# Altium schematic sheet Page B_SignalInput.SchDoc
size A1; SheetNumber: 0; SheetTotal: 0
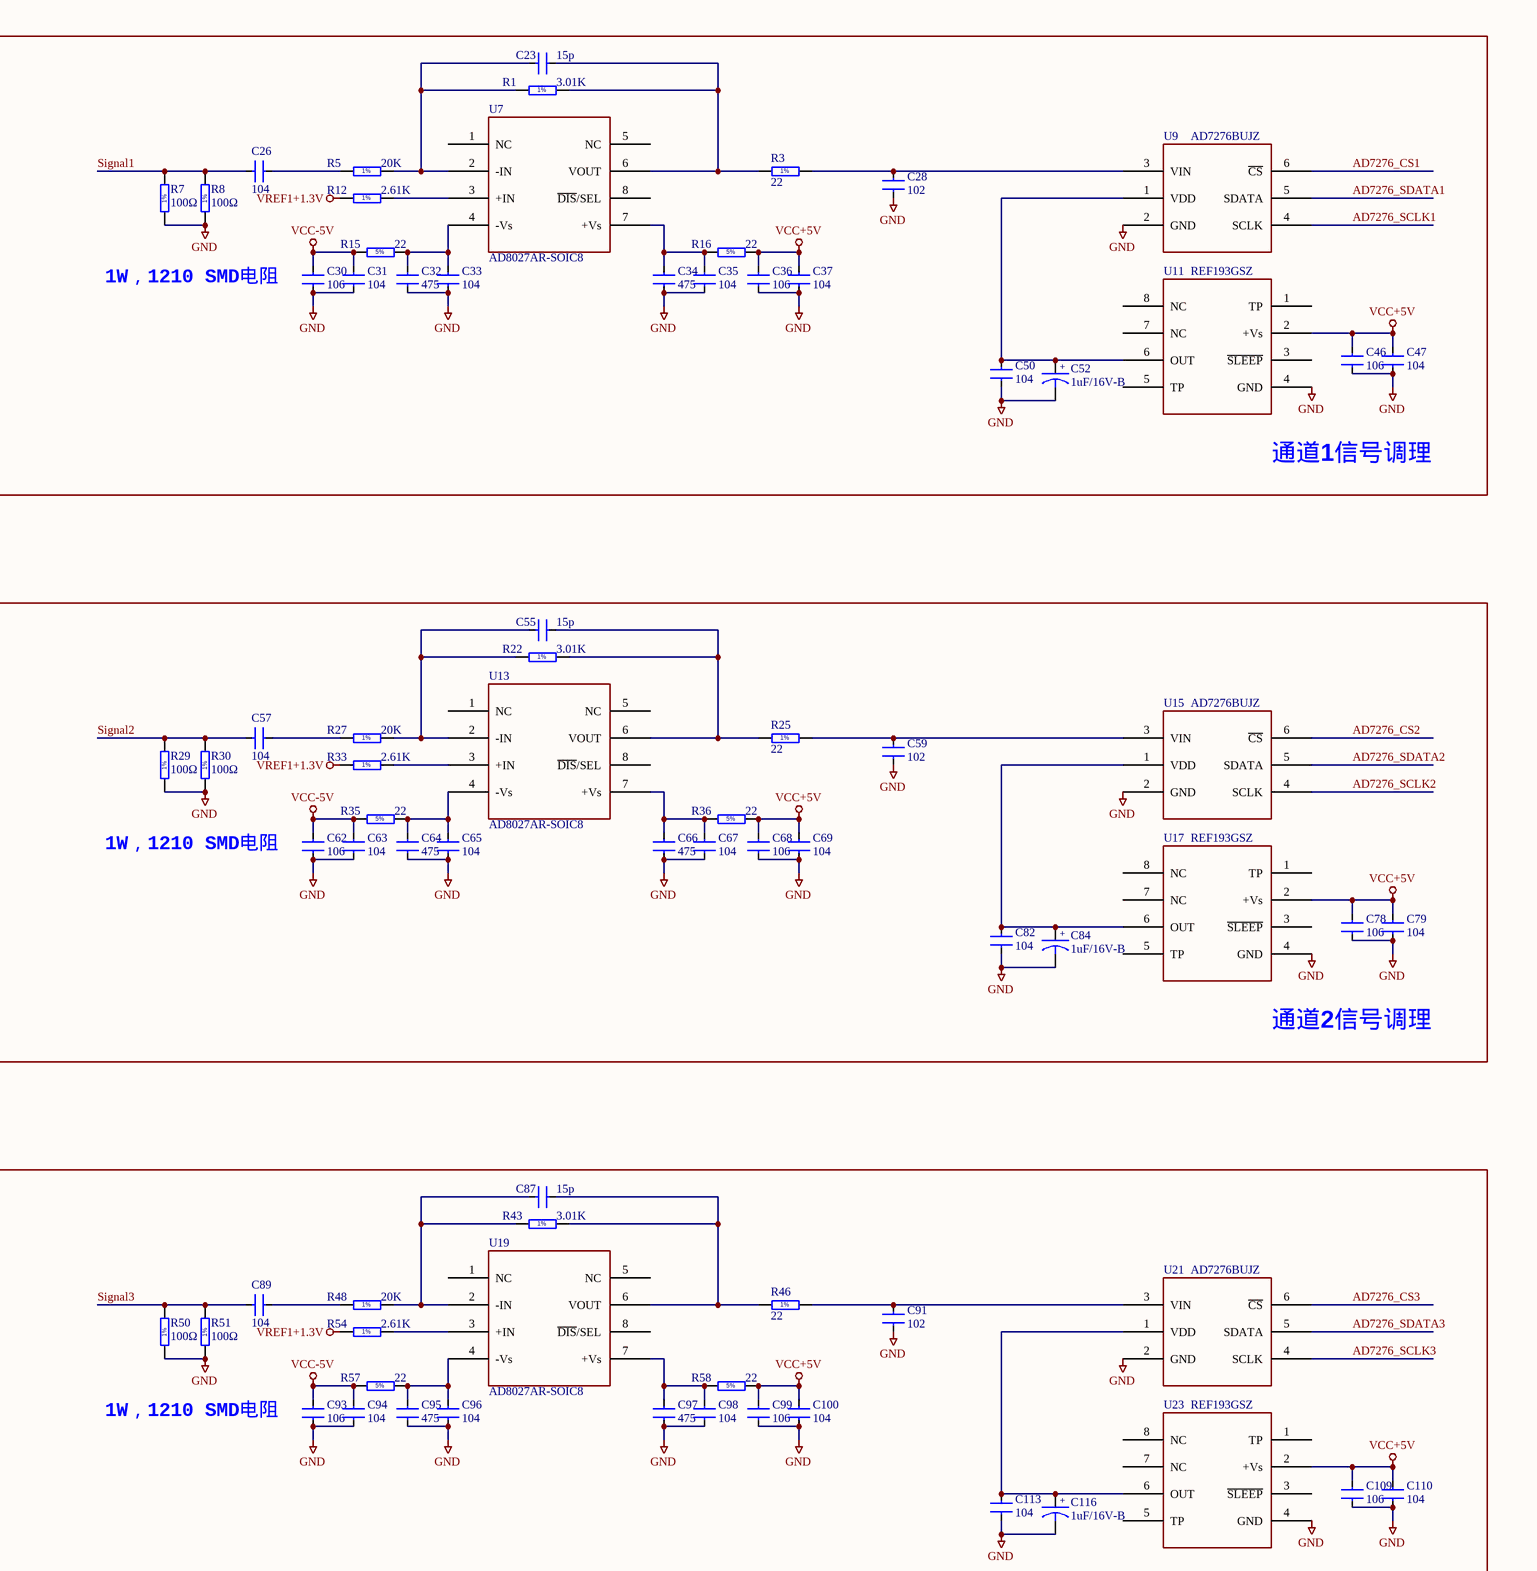
[diagram p0: Page B_SignalInput.SchDoc, top left]
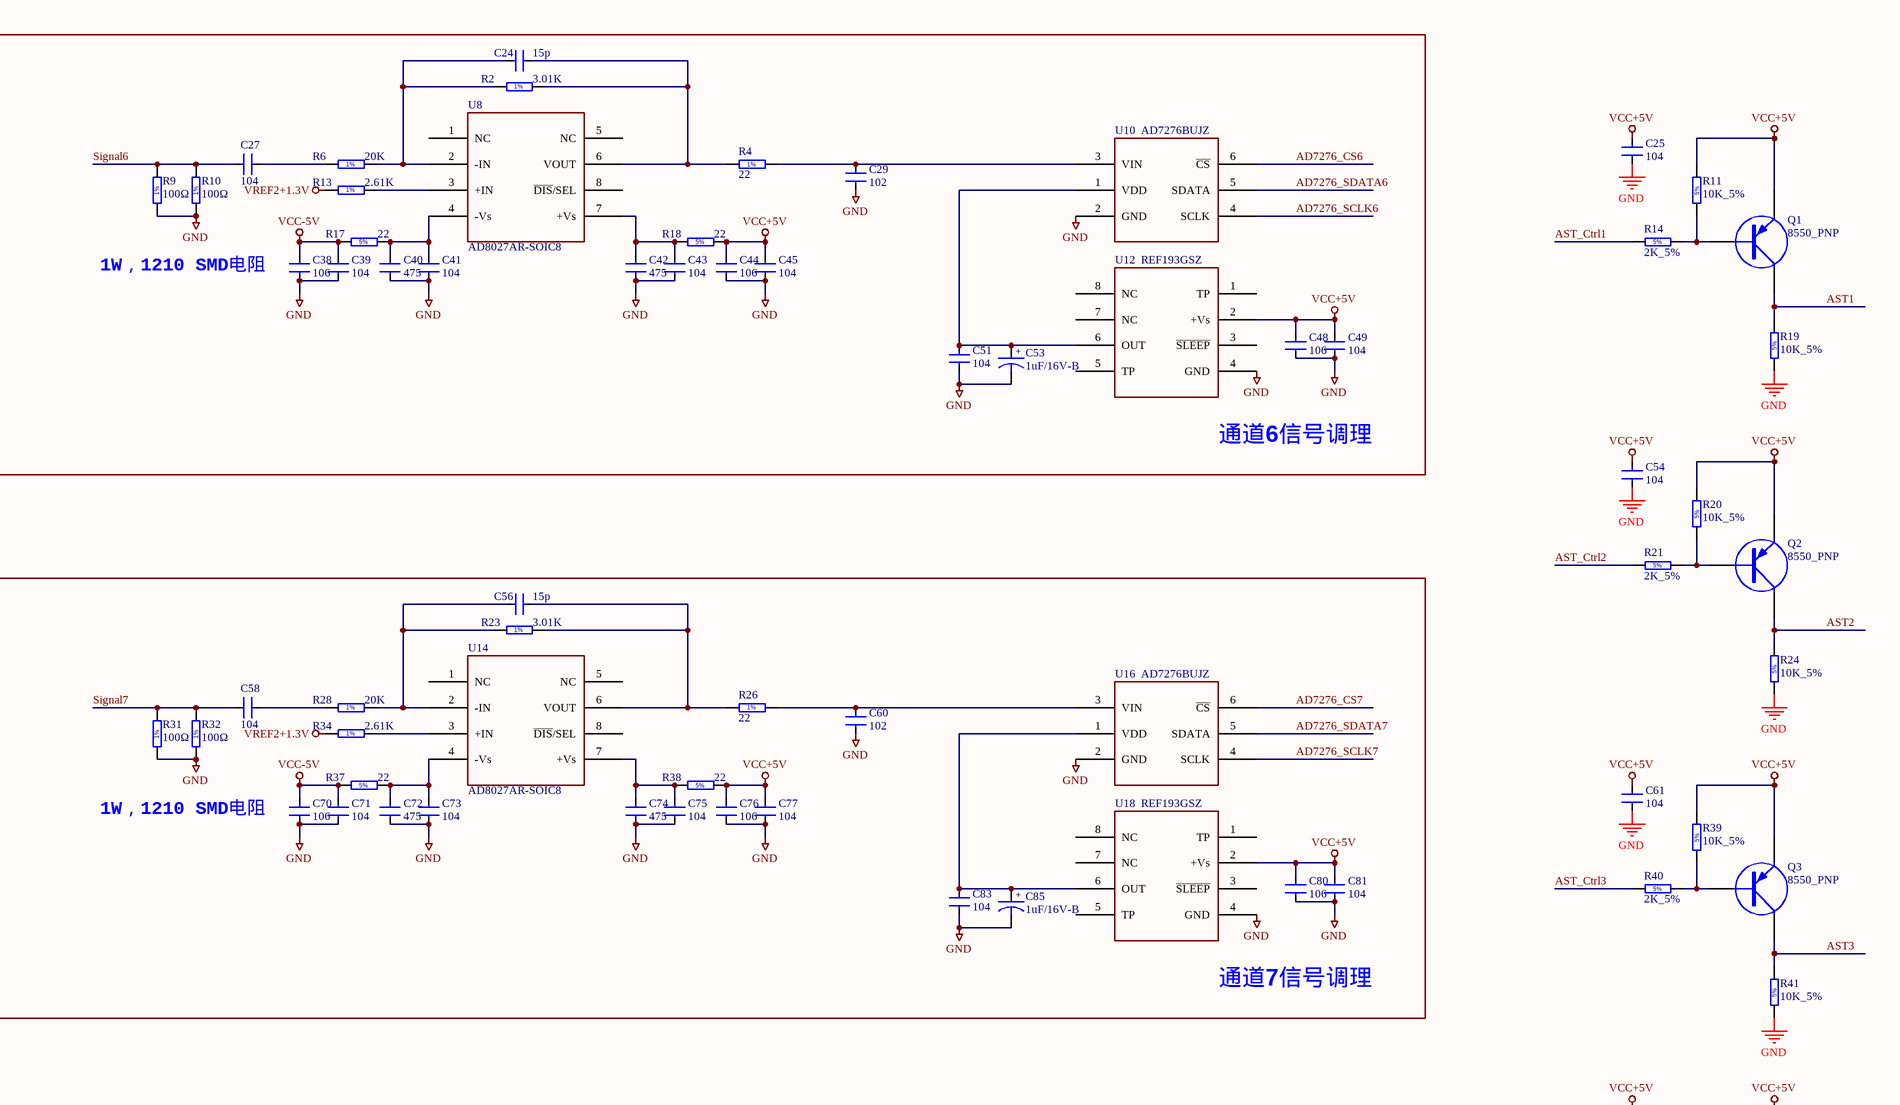
[diagram p1: Page B_SignalInput.SchDoc, top right]
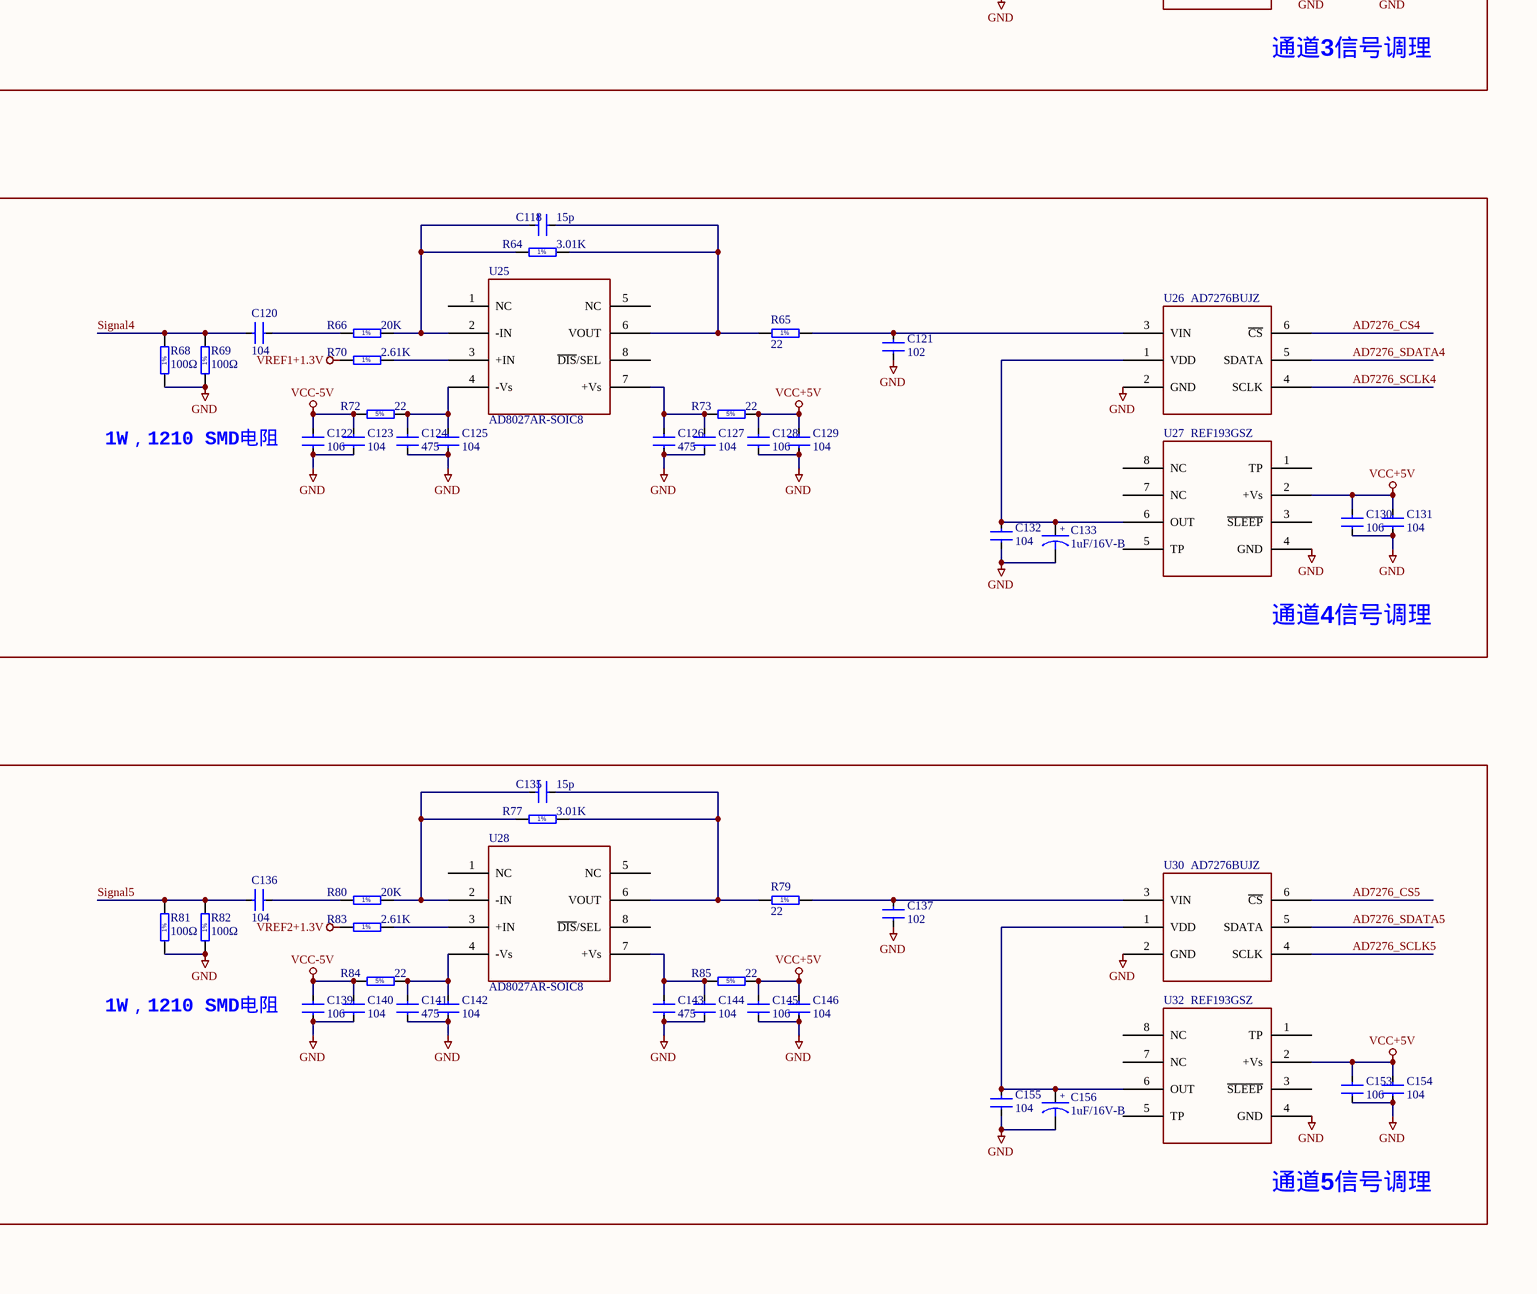
[diagram p2: Page B_SignalInput.SchDoc, bottom left]
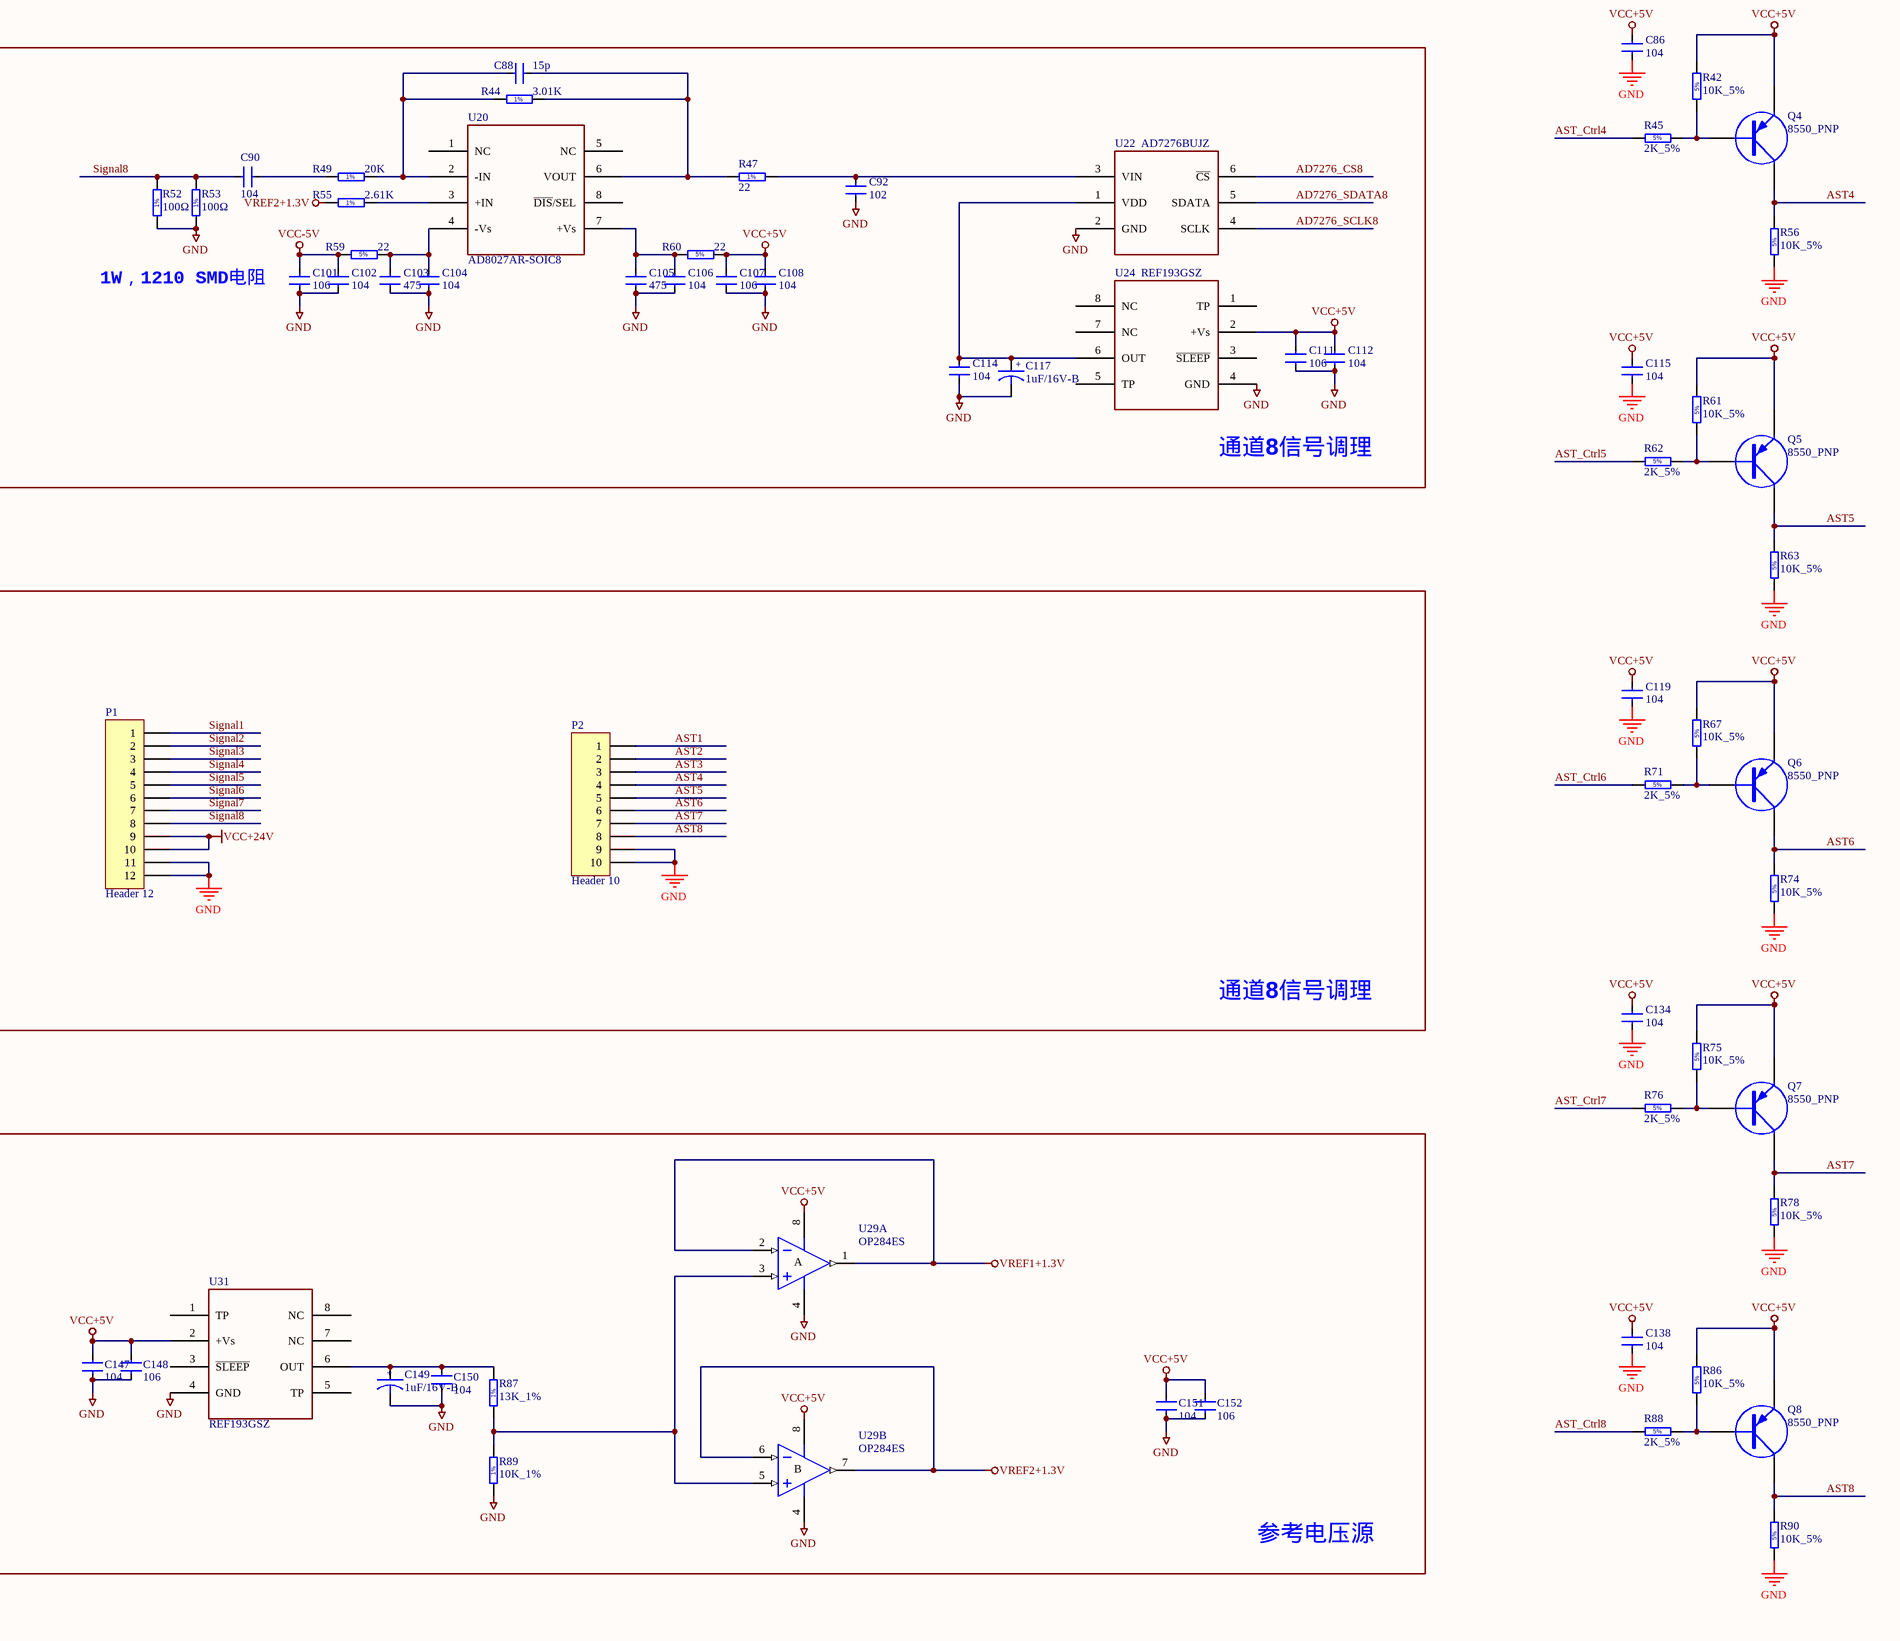
[diagram p3: Page B_SignalInput.SchDoc, bottom right]

## Parts
C23  15p  [0603C]
C24  15p  [0603C]
C25  104  [0603C]
C26  104  [0603C]
C27  104  [0603C]
C28  102  [0603C]
C29  102  [0603C]
C30  106  [0603C]
C31  104  [0603C]
C32  475  [0603C]
C33  104  [0603C]
C34  475  [0603C]
C35  104  [0603C]
C36  106  [0603C]
C37  104  [0603C]
C38  106  [0603C]
C39  104  [0603C]
C40  475  [0603C]
C41  104  [0603C]
C42  475  [0603C]
C43  104  [0603C]
C44  106  [0603C]
C45  104  [0603C]
C46  106  [0603C]
C47  104  [0603C]
C48  106  [0603C]
C49  104  [0603C]
C50  104  [0603C]
C51  104  [0603C]
C52  1uF/16V-B  [TCC-B]
C53  1uF/16V-B  [TCC-B]
C54  104  [0603C]
C55  15p  [0603C]
C56  15p  [0603C]
C57  104  [0603C]
C58  104  [0603C]
C59  102  [0603C]
C60  102  [0603C]
C61  104  [0603C]
C62  106  [0603C]
C63  104  [0603C]
C64  475  [0603C]
C65  104  [0603C]
C66  475  [0603C]
C67  104  [0603C]
C68  106  [0603C]
C69  104  [0603C]
C70  106  [0603C]
C71  104  [0603C]
C72  475  [0603C]
C73  104  [0603C]
C74  475  [0603C]
C75  104  [0603C]
C76  106  [0603C]
C77  104  [0603C]
C78  106  [0603C]
C79  104  [0603C]
C80  106  [0603C]
C81  104  [0603C]
C82  104  [0603C]
C83  104  [0603C]
C84  1uF/16V-B  [TCC-B]
C85  1uF/16V-B  [TCC-B]
C86  104  [0603C]
C87  15p  [0603C]
C88  15p  [0603C]
C89  104  [0603C]
C90  104  [0603C]
C91  102  [0603C]
C92  102  [0603C]
C93  106  [0603C]
C94  104  [0603C]
C95  475  [0603C]
C96  104  [0603C]
C97  475  [0603C]
C98  104  [0603C]
C99  106  [0603C]
C100  104  [0603C]
C101  106  [0603C]
C102  104  [0603C]
C103  475  [0603C]
C104  104  [0603C]
C105  475  [0603C]
C106  104  [0603C]
C107  106  [0603C]
C108  104  [0603C]
C109  106  [0603C]
C110  104  [0603C]
C111  106  [0603C]
C112  104  [0603C]
C113  104  [0603C]
C114  104  [0603C]
C115  104  [0603C]
C116  1uF/16V-B  [TCC-B]
C117  1uF/16V-B  [TCC-B]
C118  15p  [0603C]
C119  104  [0603C]
C120  104  [0603C]
C121  102  [0603C]
C122  106  [0603C]
C123  104  [0603C]
C124  475  [0603C]
C125  104  [0603C]
C126  475  [0603C]
C127  104  [0603C]
C128  106  [0603C]
C129  104  [0603C]
C130  106  [0603C]
C131  104  [0603C]
C132  104  [0603C]
C133  1uF/16V-B  [TCC-B]
C134  104  [0603C]
C135  15p  [0603C]
C136  104  [0603C]
C137  102  [0603C]
C138  104  [0603C]
C139  106  [0603C]
C140  104  [0603C]
C141  475  [0603C]
C142  104  [0603C]
C143  475  [0603C]
C144  104  [0603C]
C145  106  [0603C]
C146  104  [0603C]
C147  104  [0603C]
C148  106  [0603C]
C149  1uF/16V-B  [TCC-B]
C150  104  [0603C]
C151  104  [0603C]
C152  106  [0603C]
C153  106  [0603C]
C154  104  [0603C]
C155  104  [0603C]
C156  1uF/16V-B  [TCC-B]
P1  Header 12  [CHAZUO12*2.54]
P2  Header 10  [CHAZUO10*2.54]
Q1  8550_PNP  [SOT-23]
Q2  8550_PNP  [SOT-23]
Q3  8550_PNP  [SOT-23]
Q4  8550_PNP  [SOT-23]
Q5  8550_PNP  [SOT-23]
Q6  8550_PNP  [SOT-23]
Q7  8550_PNP  [SOT-23]
Q8  8550_PNP  [SOT-23]
R1  3.01K  [0603R]
R2  3.01K  [0603R]
R3  22  [0603R]
R4  22  [0603R]
R5  20K  [0603R]
R6  20K  [0603R]
R7  100Ω  [1210]
R8  100Ω  [1210]
R9  100Ω  [1210]
R10  100Ω  [1210]
R11  10K_5%  [0603R]
R12  2.61K  [0603R]
R13  2.61K  [0603R]
R14  2K_5%  [0603R]
R15  22  [0603R]
R16  22  [0603R]
R17  22  [0603R]
R18  22  [0603R]
R19  10K_5%  [0603R]
R20  10K_5%  [0603R]
R21  2K_5%  [0603R]
R22  3.01K  [0603R]
R23  3.01K  [0603R]
R24  10K_5%  [0603R]
R25  22  [0603R]
R26  22  [0603R]
R27  20K  [0603R]
R28  20K  [0603R]
R29  100Ω  [1210]
R30  100Ω  [1210]
R31  100Ω  [1210]
R32  100Ω  [1210]
R33  2.61K  [0603R]
R34  2.61K  [0603R]
R35  22  [0603R]
R36  22  [0603R]
R37  22  [0603R]
R38  22  [0603R]
R39  10K_5%  [0603R]
R40  2K_5%  [0603R]
R41  10K_5%  [0603R]
R42  10K_5%  [0603R]
R43  3.01K  [0603R]
R44  3.01K  [0603R]
R45  2K_5%  [0603R]
R46  22  [0603R]
R47  22  [0603R]
R48  20K  [0603R]
R49  20K  [0603R]
R50  100Ω  [1210]
R51  100Ω  [1210]
R52  100Ω  [1210]
R53  100Ω  [1210]
R54  2.61K  [0603R]
R55  2.61K  [0603R]
R56  10K_5%  [0603R]
R57  22  [0603R]
R58  22  [0603R]
R59  22  [0603R]
R60  22  [0603R]
R61  10K_5%  [0603R]
R62  2K_5%  [0603R]
R63  10K_5%  [0603R]
R64  3.01K  [0603R]
R65  22  [0603R]
R66  20K  [0603R]
R67  10K_5%  [0603R]
R68  100Ω  [1210]
R69  100Ω  [1210]
R70  2.61K  [0603R]
R71  2K_5%  [0603R]
R72  22  [0603R]
R73  22  [0603R]
R74  10K_5%  [0603R]
R75  10K_5%  [0603R]
R76  2K_5%  [0603R]
R77  3.01K  [0603R]
R78  10K_5%  [0603R]
R79  22  [0603R]
R80  20K  [0603R]
R81  100Ω  [1210]
R82  100Ω  [1210]
R83  2.61K  [0603R]
R84  22  [0603R]
R85  22  [0603R]
R86  10K_5%  [0603R]
R87  13K_1%  [0603R]
R88  2K_5%  [0603R]
R89  10K_1%  [0603R]
R90  10K_5%  [0603R]
U7  AD8027AR-SOIC8  [SO-8N]
U8  AD8027AR-SOIC8  [SO-8N]
U9  AD7276BUJZ  [SOT-23-6]
U10  AD7276BUJZ  [SOT-23-6]
U11  REF193GSZ  [SO-8N]
U12  REF193GSZ  [SO-8N]
U13  AD8027AR-SOIC8  [SO-8N]
U14  AD8027AR-SOIC8  [SO-8N]
U15  AD7276BUJZ  [SOT-23-6]
U16  AD7276BUJZ  [SOT-23-6]
U17  REF193GSZ  [SO-8N]
U18  REF193GSZ  [SO-8N]
U19  AD8027AR-SOIC8  [SO-8N]
U20  AD8027AR-SOIC8  [SO-8N]
U21  AD7276BUJZ  [SOT-23-6]
U22  AD7276BUJZ  [SOT-23-6]
U23  REF193GSZ  [SO-8N]
U24  REF193GSZ  [SO-8N]
U25  AD8027AR-SOIC8  [SO-8N]
U26  AD7276BUJZ  [SOT-23-6]
U27  REF193GSZ  [SO-8N]
U28  AD8027AR-SOIC8  [SO-8N]
U29  OP284ES  [SO-8_N]  (parts A,B of 2)
U30  AD7276BUJZ  [SOT-23-6]
U31  REF193GSZ  [SO-8N]
U32  REF193GSZ  [SO-8N]

## Blocks framed on the sheet
通道1信号调理: C23 C26 C28 C30-C37 C46 C47 C50 C52 R1 R3 R5 R7 R8 R12 R15 R16 U7 U9 U11
通道6信号调理: C24 C27 C29 C38-C45 C48 C49 C51 C53 R2 R4 R6 R9 R10 R13 R17 R18 U8 U10 U12
通道2信号调理: C55 C57 C59 C62-C69 C78 C79 C82 C84 R22 R25 R27 R29 R30 R33 R35 R36 U13 U15 U17
通道7信号调理: C56 C58 C60 C70-C77 C80 C81 C83 C85 R23 R26 R28 R31 R32 R34 R37 R38 U14 U16 U18
通道3信号调理: C87 C89 C91 C93-C100 C109 C110 C113 C116 R43 R46 R48 R50 R51 R54 R57 R58 U19 U21 U23
通道8信号调理: C88 C90 C92 C101-C108 C111 C112 C114 C117 R44 R47 R49 R52 R53 R55 R59 R60 U20 U22 U24
通道4信号调理: C118 C120-C133 R64-R66 R68-R70 R72 R73 U25-U27
通道8信号调理: P1 P2
通道5信号调理: C135-C137 C139-C146 C153-C156 R77 R79-R85 U28 U30 U32
参考电压源: C147-C152 R87 R89 U29 U31

## Nets
GND: C25.1 C28.1 C29.1 C30.1 C31.1 C32.1 C33.1 C34.1 C35.1 C36.1 C37.1 C38.1 C39.1 C40.1 C41.1 C42.1 C43.1 C44.1 C45.1 C46.1 C47.1 C48.1 C49.1 C50.1 C51.1 C52.2 C53.2 C54.1 C59.1 C60.1 C61.1 C62.1 C63.1 C64.1 C65.1 C66.1 C67.1 C68.1 C69.1 C70.1 C71.1 C72.1 C73.1 C74.1 C75.1 C76.1 C77.1 C78.1 C79.1 C80.1 C81.1 C82.1 C83.1 C84.2 C85.2 C86.1 C91.1 C92.1 C93.1 C94.1 C95.1 C96.1 C97.1 C98.1 C99.1 C100.1 C101.1 C102.1 C103.1 C104.2 C105.1 C106.1 C107.1 C108.1 C109.1 C110.1 C111.1 C112.1 C113.1 C114.1 C115.1 C116.2 C117.2 C119.1 C121.1 C122.1 C123.1 C124.1 C125.1 C126.1 C127.1 C128.1 C129.1 C130.1 C131.1 C132.1 C133.2 C134.1 C137.1 C138.1 C139.1 C140.1 C141.1 C142.1 C143.1 C144.1 C145.1 C146.1 C147.1 C148.1 C149.2 C150.1 C151.1 C152.1 C153.1 C154.1 C155.1 C156.2 P1.11 P1.12 P2.9 P2.10 R7.1 R8.1 R9.1 R10.1 R19.1 R24.1 R29.1 R30.1 R31.1 R32.1 R41.1 R50.1 R51.1 R52.1 R53.1 R56.1 R63.1 R68.1 R69.1 R74.1 R78.1 R81.1 R82.1 R89.1 R90.1 U9.2(GND) U10.2(GND) U11.4(GND) U12.4(GND) U15.2(GND) U16.2(GND) U17.4(GND) U18.4(GND) U21.2(GND) U22.2(GND) U23.4(GND) U24.4(GND) U26.2(GND) U27.4(GND) U29.4(V-) U30.2(GND) U31.4(GND) U32.4(GND)
VCC+5V: C25.2 C36.2 C37.2 C44.2 C45.2 C46.2 C47.2 C48.2 C49.2 C54.2 C61.2 C68.2 C69.2 C76.2 C77.2 C78.2 C79.2 C80.2 C81.2 C86.2 C99.2 C100.2 C107.2 C108.2 C109.2 C110.2 C111.2 C112.2 C115.2 C119.2 C128.2 C129.2 C130.2 C131.2 C134.2 C138.2 C145.2 C146.2 C147.2 C148.2 C151.2 C152.2 C153.2 C154.2 Q1.2(E) Q2.2(E) Q3.2(E) Q4.2(E) Q5.2(E) Q6.2(E) Q7.2(E) Q8.2(E) R11.2 R16.2 R18.2 R20.2 R36.2 R38.2 R39.2 R42.2 R58.2 R60.2 R61.2 R67.2 R73.2 R75.2 R85.2 R86.2 U11.2(+Vs) U12.2(+Vs) U17.2(+Vs) U18.2(+Vs) U23.2(+Vs) U24.2(+Vs) U27.2(+Vs) U29.8(V+) U31.2(+Vs) U32.2(+Vs)
VCC+24V: P1.9 P1.10
VCC-5V: C30.2 C31.2 C38.2 C39.2 C62.2 C63.2 C70.2 C71.2 C93.2 C94.2 C101.2 C102.2 C122.2 C123.2 C139.2 C140.2 R15.1 R17.1 R35.1 R37.1 R57.1 R59.1 R72.1 R84.1
VREF1+1.3V: R12.1 R33.1 R54.1 R70.1 U29.1(OUT) U29.2(IN-)
VREF2+1.3V: R13.1 R34.1 R55.1 R83.1 U29.6(IN-) U29.7(OUT)
AD7276_CS1: U9.6(~{CS})
AD7276_CS2: U15.6(~{CS})
AD7276_CS3: U21.6(~{CS})
AD7276_CS4: U26.6(~{CS})
AD7276_CS5: U30.6(~{CS})
AD7276_CS6: U10.6(~{CS})
AD7276_CS7: U16.6(~{CS})
AD7276_CS8: U22.6(~{CS})
AD7276_SCLK1: U9.4(SCLK)
AD7276_SCLK2: U15.4(SCLK)
AD7276_SCLK3: U21.4(SCLK)
AD7276_SCLK4: U26.4(SCLK)
AD7276_SCLK5: U30.4(SCLK)
AD7276_SCLK6: U10.4(SCLK)
AD7276_SCLK7: U16.4(SCLK)
AD7276_SCLK8: U22.4(SCLK)
AD7276_SDATA1: U9.5(SDATA)
AD7276_SDATA2: U15.5(SDATA)
AD7276_SDATA3: U21.5(SDATA)
AD7276_SDATA4: U26.5(SDATA)
AD7276_SDATA5: U30.5(SDATA)
AD7276_SDATA6: U10.5(SDATA)
AD7276_SDATA7: U16.5(SDATA)
AD7276_SDATA8: U22.5(SDATA)
AST1: P2.1 Q1.3(C) R19.2
AST2: P2.2 Q2.3(C) R24.2
AST3: P2.3 Q3.3(C) R41.2
AST4: P2.4 Q4.3(C) R56.2
AST5: P2.5 Q5.3(C) R63.2
AST6: P2.6 Q6.3(C) R74.2
AST7: P2.7 Q7.3(C) R78.2
AST8: P2.8 Q8.3(C) R90.2
AST_Ctrl1: R14.1
AST_Ctrl2: R21.1
AST_Ctrl3: R40.1
AST_Ctrl4: R45.1
AST_Ctrl5: R62.1
AST_Ctrl6: R71.1
AST_Ctrl7: R76.1
AST_Ctrl8: R88.1
Signal1: C26.1 P1.1 R7.2 R8.2
Signal2: C57.1 P1.2 R29.2 R30.2
Signal3: C89.1 P1.3 R50.2 R51.2
Signal4: C120.1 P1.4 R68.2 R69.2
Signal5: C136.1 P1.5 R81.2 R82.2
Signal6: C27.1 P1.6 R9.2 R10.2
Signal7: C58.1 P1.7 R31.2 R32.2
Signal8: C90.1 P1.8 R52.2 R53.2
NetC23_1: C23.1 R1.2 R3.1 U7.6(VOUT)
NetC23_2: C23.2 R1.1 R5.2 U7.2(-IN)
NetC24_1: C24.1 R2.2 R4.1 U8.6(VOUT)
NetC24_2: C24.2 R2.1 R6.2 U8.2(-IN)
NetC26_2: C26.2 R5.1
NetC27_2: C27.2 R6.1
NetC28_2: C28.2 R3.2 U9.3(VIN)
NetC29_2: C29.2 R4.2 U10.3(VIN)
NetC32_2: C32.2 C33.2 R15.2 U7.4(-Vs)
NetC34_2: C34.2 C35.2 R16.1 U7.7(+Vs)
NetC40_2: C40.2 C41.2 R17.2 U8.4(-Vs)
NetC42_2: C42.2 C43.2 R18.1 U8.7(+Vs)
NetC50_2: C50.2 C52.1 U9.1(VDD) U11.6(OUT)
NetC51_2: C51.2 C53.1 U10.1(VDD) U12.6(OUT)
NetC55_1: C55.1 R22.2 R25.1 U13.6(VOUT)
NetC55_2: C55.2 R22.1 R27.2 U13.2(-IN)
NetC56_1: C56.1 R23.2 R26.1 U14.6(VOUT)
NetC56_2: C56.2 R23.1 R28.2 U14.2(-IN)
NetC57_2: C57.2 R27.1
NetC58_2: C58.2 R28.1
NetC59_2: C59.2 R25.2 U15.3(VIN)
NetC60_2: C60.2 R26.2 U16.3(VIN)
NetC64_2: C64.2 C65.2 R35.2 U13.4(-Vs)
NetC66_2: C66.2 C67.2 R36.1 U13.7(+Vs)
NetC72_2: C72.2 C73.2 R37.2 U14.4(-Vs)
NetC74_2: C74.2 C75.2 R38.1 U14.7(+Vs)
NetC82_2: C82.2 C84.1 U15.1(VDD) U17.6(OUT)
NetC83_2: C83.2 C85.1 U16.1(VDD) U18.6(OUT)
NetC87_1: C87.1 R43.2 R46.1 U19.6(VOUT)
NetC87_2: C87.2 R43.1 R48.2 U19.2(-IN)
NetC88_1: C88.1 R44.2 R47.1 U20.6(VOUT)
NetC88_2: C88.2 R44.1 R49.2 U20.2(-IN)
NetC89_2: C89.2 R48.1
NetC90_2: C90.2 R49.1
NetC91_2: C91.2 R46.2 U21.3(VIN)
NetC92_2: C92.2 R47.2 U22.3(VIN)
NetC95_2: C95.2 C96.2 R57.2 U19.4(-Vs)
NetC97_2: C97.2 C98.2 R58.1 U19.7(+Vs)
NetC103_2: C103.2 C104.1 R59.2 U20.4(-Vs)
NetC105_2: C105.2 C106.2 R60.1 U20.7(+Vs)
NetC113_2: C113.2 C116.1 U21.1(VDD) U23.6(OUT)
NetC114_2: C114.2 C117.1 U22.1(VDD) U24.6(OUT)
NetC118_1: C118.1 R64.2 R65.1 U25.6(VOUT)
NetC118_2: C118.2 R64.1 R66.2 U25.2(-IN)
NetC120_2: C120.2 R66.1
NetC121_2: C121.2 R65.2 U26.3(VIN)
NetC124_2: C124.2 C125.2 R72.2 U25.4(-Vs)
NetC126_2: C126.2 C127.2 R73.1 U25.7(+Vs)
NetC132_2: C132.2 C133.1 U26.1(VDD) U27.6(OUT)
NetC135_1: C135.1 R77.2 R79.1 U28.6(VOUT)
NetC135_2: C135.2 R77.1 R80.2 U28.2(-IN)
NetC136_2: C136.2 R80.1
NetC137_2: C137.2 R79.2 U30.3(VIN)
NetC141_2: C141.2 C142.2 R84.2 U28.4(-Vs)
NetC143_2: C143.2 C144.2 R85.1 U28.7(+Vs)
NetC149_1: C149.1 C150.2 R87.2 U31.6(OUT)
NetC155_2: C155.2 C156.1 U30.1(VDD) U32.6(OUT)
NetQ1_1: Q1.1(B) R11.1 R14.2
NetQ2_1: Q2.1(B) R20.1 R21.2
NetQ3_1: Q3.1(B) R39.1 R40.2
NetQ4_1: Q4.1(B) R42.1 R45.2
NetQ5_1: Q5.1(B) R61.1 R62.2
NetQ6_1: Q6.1(B) R67.1 R71.2
NetQ7_1: Q7.1(B) R75.1 R76.2
NetQ8_1: Q8.1(B) R86.1 R88.2
NetR12_2: R12.2 U7.3(+IN)
NetR13_2: R13.2 U8.3(+IN)
NetR33_2: R33.2 U13.3(+IN)
NetR34_2: R34.2 U14.3(+IN)
NetR54_2: R54.2 U19.3(+IN)
NetR55_2: R55.2 U20.3(+IN)
NetR70_2: R70.2 U25.3(+IN)
NetR83_2: R83.2 U28.3(+IN)
NetR87_1: R87.1 R89.2 U29.3(IN+) U29.5(IN+)

Not connected (* = marked no-connect by the designer): U7 1(NC) 5(NC) 8(~{DIS}/SEL); U8 1(NC) 5(NC) 8(~{DIS}/SEL); U11 1(TP) 3(~{SLEEP}) 5(TP) 7(NC) 8(NC); U12 1(TP) 3(~{SLEEP}) 5(TP) 7(NC) 8(NC); U13 1(NC) 5(NC) 8(~{DIS}/SEL); U14 1(NC) 5(NC) 8(~{DIS}/SEL); U17 1(TP) 3(~{SLEEP}) 5(TP) 7(NC) 8(NC); U18 1(TP) 3(~{SLEEP}) 5(TP) 7(NC) 8(NC); U19 1(NC) 5(NC) 8(~{DIS}/SEL); U20 1(NC) 5(NC) 8(~{DIS}/SEL); U23 1(TP) 3(~{SLEEP}) 5(TP) 7(NC) 8(NC); U24 1(TP) 3(~{SLEEP}) 5(TP) 7(NC) 8(NC); U25 1(NC) 5(NC) 8(~{DIS}/SEL); U27 1(TP) 3(~{SLEEP}) 5(TP) 7(NC) 8(NC); U28 1(NC) 5(NC) 8(~{DIS}/SEL); U31 1(TP) 3(~{SLEEP}) 5(TP) 7(NC) 8(NC); U32 1(TP) 3(~{SLEEP}) 5(TP) 7(NC) 8(NC)

## Notes on the sheet
- (near C30) 1W，1210 SMD电阻
- (near C38) 1W，1210 SMD电阻
- (near C62) 1W，1210 SMD电阻
- (near C70) 1W，1210 SMD电阻
- (near C93) 1W，1210 SMD电阻
- (near C101) 1W，1210 SMD电阻
- (near C122) 1W，1210 SMD电阻
- (near C139) 1W，1210 SMD电阻
- (in symbol 10uF/16V-B) +
- (in symbol OP284ES, part A) A
- (in symbol OP284ES, part B) B
- (in symbol Resistor - 1%) 1%
- (in symbol Resistor - 5%) 5%

## Library data of the parts
C23-C51 C54-C83 C86-C115 C118-C132 C134-C148 C150-C155 = C-X5R/X7R
C52 C53 C84 C85 C116 C117 C133 C149 C156 = 10uF/16V-B
P1 = Header 12: Header, 12-Pin; LatestRevisionDate: 17-Jul-2002; LatestRevisionNote: Re-released for DXP Platform.; Publisher: Altium Limited
P2 = Header 10: Header, 10-Pin; LatestRevisionDate: 17-Jul-2002; LatestRevisionNote: Re-released for DXP Platform.; Publisher: Altium Limited
Q1-Q8 = PNP: PNP Transistor
R1-R10 R12 R13 R22 R23 R25-R34 R43 R44 R46-R55 R64-R66 R68-R70 R77 R79-R83 R87 R89 = Resistor - 1%
R11 R14-R21 R24 R35-R42 R45 R56-R63 R67 R71-R76 R78 R84-R86 R88 R90 = Resistor - 5%
U29 = OP284ES: Precision Rail-to-Rail Input and Output Operational Amplifier; Published: 8-Jun-2000; LatestRevisionDate: 13-Apr-2006; LatestRevisionNote: IPC-7351 Footprint Added.; DatasheetVersion: REV. 0 1996; PackageVersion: revA; PackageReference: SO-8; Publisher: Altium Limited; PackageDescription: 8-Pin Small Outline Integrated Circuit 1.27 mm Pitch; Code_JEDEC: MS-012-AA; Code_IPC: SOIC127P600-8; ComponentLink1Description: Manufacturer Link; ComponentLink1URL: http://www.analog.com/en/prod/0,,759_786_OP184%2C00.html; ComponentLink2Description: Datasheet; ComponentLink2URL: http://www.analog.com/UploadedFiles/Data_Sheets/390492658OP184_284_484_b.pdf; ComponentLink3Description: Discontinuation Notice; ComponentLink3URL: http://www.analog.com/UploadedFiles/Aerospace_Information/505817548385948813507767505obsolete.pdf